# EAGLE design design (EAGLE 9.5.2)
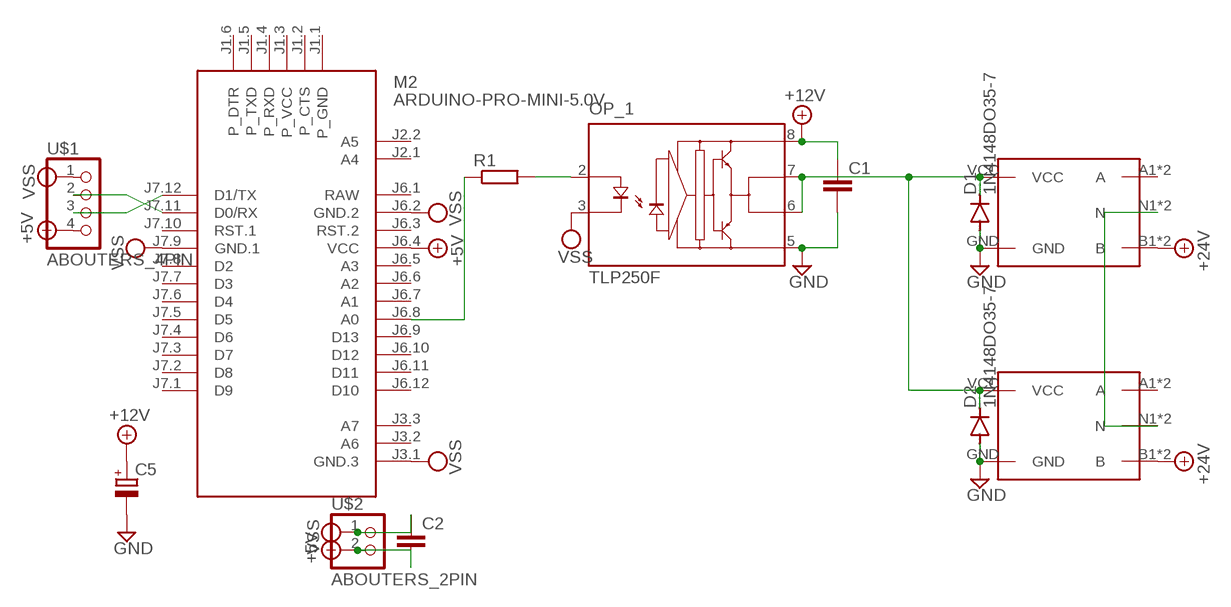
[diagram p0: schematic, sheet 1]

## Parts
C1  C-EU025-024X044  [C025-024X044]
C2  C-EU025-024X044  [C025-024X044]
C5  CPOL-EUE5-10.5  [E5-10,5]
D1  1N4148DO35-7  [DO35-7]
D2  1N4148DO35-7  [DO35-7]
HF14FW1  HF14FW  [HF14FW]
HF14FW2  HF14FW  [HF14FW]
M2  ARDUINO-PRO-MINI-5.0V  [ARDUINO-PRO-MINI]
OP_1  TLP250F  [DIL08]
R1  R-EU_0207/7  [0207/7]
U$1  ABOUTERS_4PIN  [22-23-2041]
U$2  ABOUTERS_2PIN  [22-23-2021]

## Nets
+5V: C2.2 M2.J6.4(VCC) U$1.4 U$2.2
+12V: C1.1 C5.+ OP_1.8(VCC)
+24V: HF14FW1.B1(B) HF14FW1.B2(B) HF14FW2.B1(B) HF14FW2.B2(B)
GND: C1.2 C5.- D1.A D2.A HF14FW1.GND HF14FW2.GND OP_1.5(GND)
N$1: M2.J7.11(D0/RX) U$1.2
N$2: HF14FW1.N1(N) HF14FW1.N2(N) HF14FW2.N1(N) HF14FW2.N2(N)
N$4: OP_1.2(A) R1.2
N$6: M2.J6.8(A0) R1.1
N$7: M2.J7.12(D1/TX) U$1.3
N$9: D1.C D2.C HF14FW1.VCC HF14FW2.VCC OP_1.6(VO) OP_1.7(VO')
VSS: C2.1 M2.J3.1(GND.3) M2.J6.2(GND.2) M2.J7.9(GND.1) OP_1.3(K) U$1.1 U$2.1
Unconnected: HF14FW1.A1(A) HF14FW1.A2(A) HF14FW2.A1(A) HF14FW2.A2(A) M2.J1.1(P_GND) M2.J1.2(P_CTS) M2.J1.3(P_VCC) M2.J1.4(P_RXD) M2.J1.5(P_TXD) M2.J1.6(P_DTR) M2.J2.1(A4) M2.J2.2(A5) M2.J3.2(A6) M2.J3.3(A7) M2.J6.3(RST.2) M2.J6.5(A3) M2.J6.6(A2) M2.J6.7(A1) M2.J6.9(D13) M2.J6.10(D12) M2.J6.11(D11) M2.J6.12(D10) M2.J7.1(D9) M2.J7.2(D8) M2.J7.3(D7) M2.J7.4(D6) M2.J7.5(D5) M2.J7.6(D4) M2.J7.7(D3) M2.J7.8(D2) M2.J7.10(RST.1)

## Power pins joined to a net without a drawn wire
RAW: M2.J6.1(RAW)

## Library data of the parts
C1 C2 = rcl:C-EU: CAPACITOR, European symbol; SPICEPREFIX: C
C5 = rcl:CPOL-EU: POLARIZED CAPACITOR, European symbol; SPICEPREFIX: C
D1 D2 = diode:1N4148: DIODE high speed (Philips)
HF14FW1 HF14FW2 = HF14FW:HF14FW: 【HF14FW】 eagle lib data 2019/07/14 ABOUTERS.RELAY
M2 = diy-modules:ARDUINO-PRO-MINI-*: Arduino Pro Mini and compatible devices More details available here: https://www.arduino.cc/en/Main/ArduinoBoardProMini Click here to find device on ebay.com <http://www.ebay.com/sch/arduino+pro+mini>
OP_1 = optocoupler-3-jcn:TLP250F: Toshiba Transistor Inverter Inverter For Air Conditionor IGBT Gate Drive Power MOS FET Gate Drive
R1 = rcl:R-EU_: RESISTOR, European symbol; SPICEPREFIX: R
U$1 = abouters_pin (1):ABOUTERS_4PIN
U$2 = abouters_pin (1):ABOUTERS_2PIN

## Board
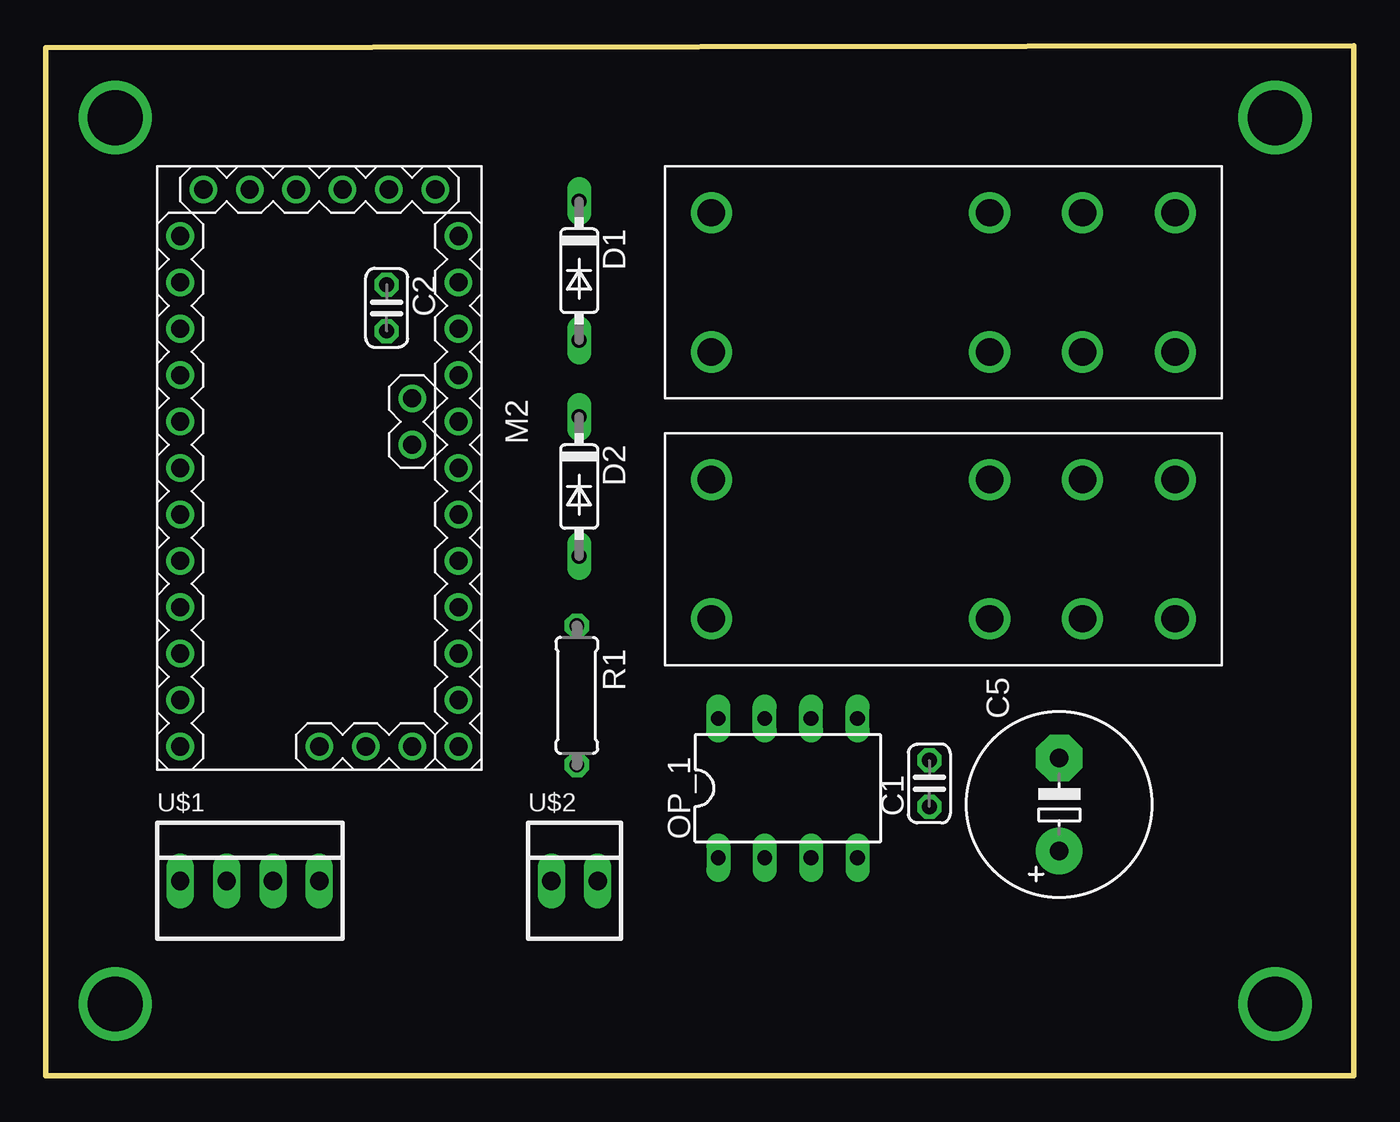
[diagram p1: board, top side]
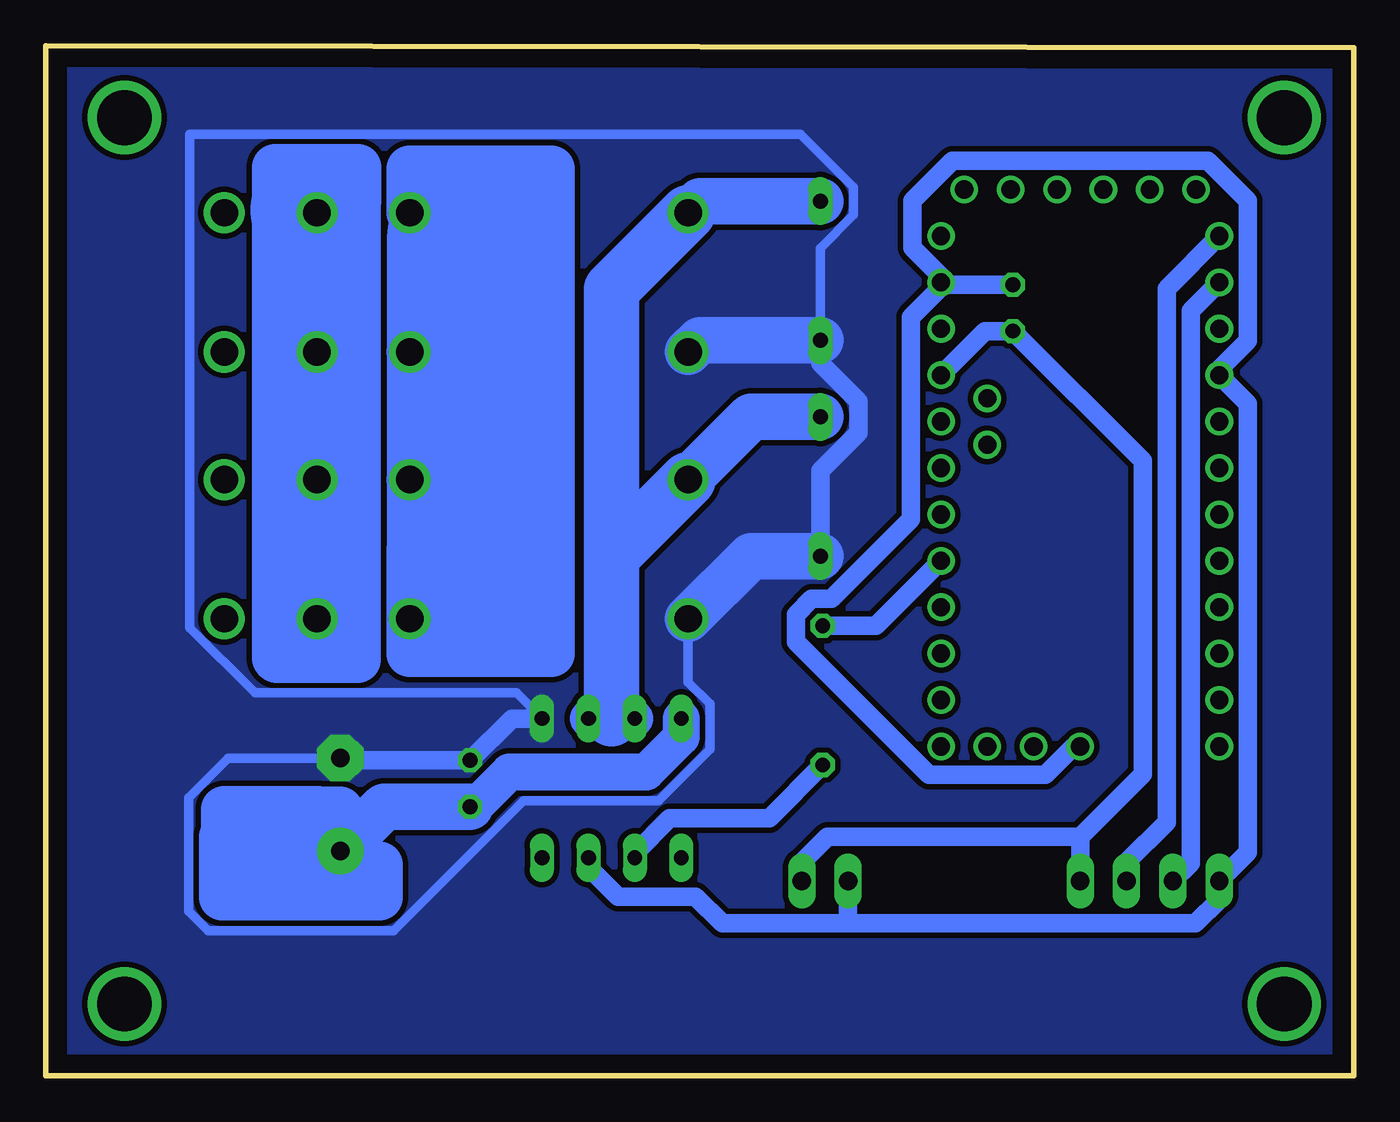
[diagram p2: board, bottom side, seen from below]

Size 71.63 x 56.39 mm. Coordinates in mm from the lower left corner, seen from the top.
Outline: 0,56.26 71.63,56.39 71.63,0 0,0 0,56.26
Copper layers (1*16): Top 0.035mm / dielectric 1.5mm / Bottom 0.035mm
Design rules "default *": minimum track width 6mil, minimum drill 0.35mm, track to track 0.3mm, track to pad 0.3mm, pad to pad 0.3mm, via to via 0.3mm, smd to smd 0.3mm, copper to edge 40mil, drill to drill 6mil, minimum pad ring 10mil, minimum via ring 8mil, stop-mask expansion 4mil, vias tented up to drill 0mil, thermal gap 10mil

### Footprints (pad centres in the part's own frame; a part is rotated, then mirrored left to right if it is on the bottom)
C025-024X044 = drill 0.813 octagon: 1 -1.27,0; 2 1.27,0
E5-10,5 = drill 1.016 pad 2.54: + -2.54,0 | drill 1.016 pad 2.54 octagon: - 2.54,0
DO35-7 = drill 0.813 long: A 3.81,0; C -3.81,0
HF14FW = drill 1.5: A1 27.94,10.16; A2 27.94,2.54; B1 17.78,10.16; B2 17.78,2.54; GND 2.54,2.54; N1 22.86,10.16; N2 22.86,2.54; VCC 2.54,10.16
ARDUINO-PRO-MINI = drill 1: J1.1 -15.24,6.35; J1.2 -15.24,3.81; J1.3 -15.24,1.27; J1.4 -15.24,-1.27; J1.5 -15.24,-3.81; J1.6 -15.24,-6.35; J2.1 -1.27,5.08; J2.2 -3.81,5.08; J3.1 15.24,0; J3.2 15.24,2.54; J3.3 15.24,5.08; J6.1 -12.7,7.62; J6.2 -10.16,7.62; J6.3 -7.62,7.62; J6.4 -5.08,7.62; J6.5 -2.54,7.62; J6.6 0,7.62; J6.7 2.54,7.62; J6.8 5.08,7.62; J6.9 7.62,7.62; J6.10 10.16,7.62; J6.11 12.7,7.62; J6.12 15.24,7.62; J7.1 15.24,-7.62; J7.2 12.7,-7.62; J7.3 10.16,-7.62; J7.4 7.62,-7.62; J7.5 5.08,-7.62; J7.6 2.54,-7.62; J7.7 0,-7.62; J7.8 -2.54,-7.62; J7.9 -5.08,-7.62; J7.10 -7.62,-7.62; J7.11 -10.16,-7.62; J7.12 -12.7,-7.62
DIL08 = drill 0.813 long: 1 -3.81,-3.81; 2 -1.27,-3.81; 3 1.27,-3.81; 4 3.81,-3.81; 5 3.81,3.81; 6 1.27,3.81; 7 -1.27,3.81; 8 -3.81,3.81
0207/7 = drill 0.813 octagon: 1 -3.81,0; 2 3.81,0
22-23-2041 = drill 1 long: 1 -3.81,0; 2 -1.27,0; 3 1.27,0; 4 3.81,0
22-23-2021 = drill 1 long: 1 -1.27,0; 2 1.27,0

### Placement (x,y rotation side)
C1  48.39,16 90 top
C2  18.67,42.04 270 top
C5  55.5,14.86 90 top
D1  29.21,44.07 270 top
D2  29.21,32.26 270 top
HF14FW1  33.91,37.08 0 top
HF14FW2  33.91,22.48 0 top
M2  14.99,33.27 270 top
OP_1  40.64,15.75 0 top
R1  29.08,20.83 270 top
U$1  11.18,10.67 0 top
U$2  28.96,10.67 0 top

### Tracks (layer width: path | path; a pad name or v marks a point on that pad's centre or on a via)
+5V
  Bottom 1.016: U$2.2 30.23,11.68 28.83,13.08 14.99,13.08 | U$1.4 14.99,13.08 | 14.99,13.08 11.56,16.51 11.56,33.66 C2.2 20.19,40.77 M2.J6.4
+12V
  Bottom 2.032: OP_1.8 36.83,18.54 38.73,16.64 46.23,16.64 48.13,14.73 C1.1
  Bottom 2.54: C1.1 53.09,14.73 C5.+ | C5.+ 55.5,14.56 56.67,14.56 56.72,14.6 61.85,14.6 61.85,11.56 53.34,11.56 53.34,9.78 61.98,9.78 61.98,13.08 56.26,13.08 C5.+
+24V
  Bottom 10.16: 47.88,45.72 47.88,39.75 47.88,32.64 47.88,26.92
  Bottom 2: HF14FW2.B2 47.88,25.02
  Bottom 2.54: 47.88,25.02 47.88,26.92 | 47.88,45.72 50.16,45.72 HF14FW1.B1 51.69,49.66 43.94,49.66 43.94,23.11 51.7,23.11 51.7,28.82 47.88,32.64 HF14FW2.B1 | HF14FW1.B2 48.01,39.62 47.88,39.75
GND
  Bottom 0.508: D1.A 29.21,45.3 27.39,47.12 27.39,48.63 30.3,51.55 63.74,51.55 63.74,24.54 60.17,20.96 45.86,20.96 OP_1.5 | HF14FW2.GND 36.45,21.55 35.26,20.37 35.26,17.89 38.08,15.07 45.47,15.07 52.58,7.96 62.73,7.96 63.8,9.02 63.8,15.23 61.63,17.4 C5.-
  Bottom 1.016: C5.- 55.37,17.27 C1.2 46.1,19.56 OP_1.5 | D2.A 29.21,33.13 27.13,35.21 27.13,36.93 29.21,39.01 D1.A
  Bottom 2.54: D1.A 35.81,40.26 HF14FW1.GND | D2.A 33.02,28.45 HF14FW2.GND
  pour Bottom (no thermals): -0.13,56.39 -0.13,-0.13 71.75,-0.13 71.75,56.52 0,56.52
N$1
  Bottom 1.016: M2.J7.11 8.93,41.87 8.93,11.65 U$1.2
N$2
  Bottom 2.54: HF14FW1.N1 55.16,47.24 54.53,47.88 54.53,49.73 59.05,49.73 59.05,22.86 58.98,22.79 54.54,22.79 54.54,25.78 56.01,25.78 HF14FW2.N2
  Bottom 7: HF14FW2.N2 HF14FW2.N1 HF14FW1.N2 HF14FW1.N1 56.92,47.4
N$3  (via drill 3)
  other vias: 3.81,52.45
N$4
  Bottom 1.016: R1.2 32,14.1 37.47,14.1 39.37,12.19 OP_1.2
N$5  (via drill 3)
  other vias: 67.31,52.45
N$6
  Bottom 1.016: M2.J6.8 26.16,24.64 R1.1
N$7
  Bottom 1.016: U$1.3 12.45,11.68 10.24,13.89 10.24,43.1 M2.J7.12
N$8  (via drill 3)
  other vias: 3.81,3.94
N$9
  Bottom 2.032: OP_1.7 40.64,19.56 OP_1.6
  Bottom 2.54: D2.C 33.02,36.07 HF14FW2.VCC | D1.C 35.81,47.88 HF14FW1.VCC
  Bottom 3.048: HF14FW1.VCC 40.64,43.05 40.64,28.45 | 40.64,19.56 40.64,27.56 40.64,28.45 | HF14FW2.VCC 40.64,28.45
N$10  (via drill 3)
  other vias: 67.31,3.94
VSS
  Bottom 1.016: OP_1.3 41.91,11.43 40.29,9.81 36.04,9.81 34.58,8.35 27.69,8.35 | U$2.1 27.69,8.35 | C2.1 22.48,43.31 | 22.48,43.31 M2.J6.2 | 27.69,8.35 8.67,8.35 7.37,9.65 U$1.1 5.8,12.23 5.8,36.79 M2.J7.9 7.37,38.69 5.8,40.25 5.8,47.89 7.99,50.08 21.98,50.08 24.17,47.89 24.17,45.33 22.48,43.64 22.48,43.31 | M2.J3.1 15.32,18.03 16.88,16.47 23.25,16.47 30.55,23.77 30.55,25.25 29.69,26.11 28.61,26.11 24.26,30.46 24.26,41.53 22.48,43.31